# EAGLE design ver1.0 (EAGLE 7.3.0)
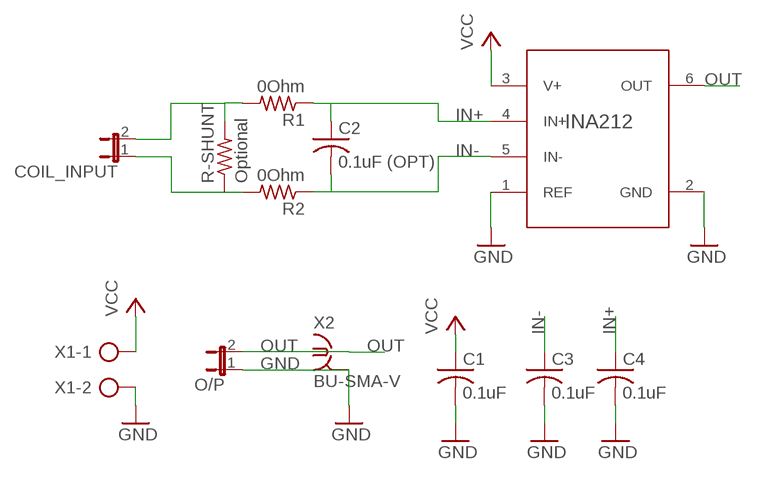
[diagram p0: schematic, sheet 1]

## Parts
C1  0.1uF  C-USC0603  [C0603]
C2  0.1uF (OPT)  C-USC0603  [C0603]
C3  0.1uF  C-USC0603  [C0603]
C4  0.1uF  C-USC0603  [C0603]
COIL_INPUT  JP1E  [JP1]
INA212  INA212AIDCKR  [DCK0006A_M]
O/P  JP1E  [JP1]
R1  0Ohm  R-US_R0603  [R0603]
R2  0Ohm  R-US_R0603  [R0603]
R-SHUNT  Optional  R-US_R0603  [R0603]
X1  AK500/2  [AK500/2]
X2  BU-SMA-V  [BU-SMA-V]

## Nets
GND: C1.2 C3.2 C4.2 INA212.1(REF) INA212.2(GND) O/P.1 X1.2 X2.2 X2.3 X2.4 X2.5
IN+: C2.1 C4.1 INA212.4(IN+) R1.1
IN-: C2.2 C3.1 INA212.5(IN-) R2.1
N$3: COIL_INPUT.2 R1.2 R-SHUNT.2
N$4: COIL_INPUT.1 R2.2 R-SHUNT.1
OUT: INA212.6(OUT) O/P.2 X2.1
VCC: C1.1 INA212.3(V+) X1.1

## Library data of the parts
C1-C4 = rcl:C-US: CAPACITOR, American symbol
COIL_INPUT O/P = jumper:JP1E: JUMPER
INA212 = INA212-BIDCKR:INA212AIDCKR
R1 R2 R-SHUNT = rcl:R-US_: RESISTOR, American symbol
X1 = con-ptr500:AK500/2: CONNECTOR; OC_FARNELL: unknown; OC_NEWARK: unknown
X2 = con-coax:BU-SMA-V: FEMALE SMA CONNECTOR Radiall distributor RS 112-3794; OC_FARNELL: unknown; OC_NEWARK: unknown

## Board
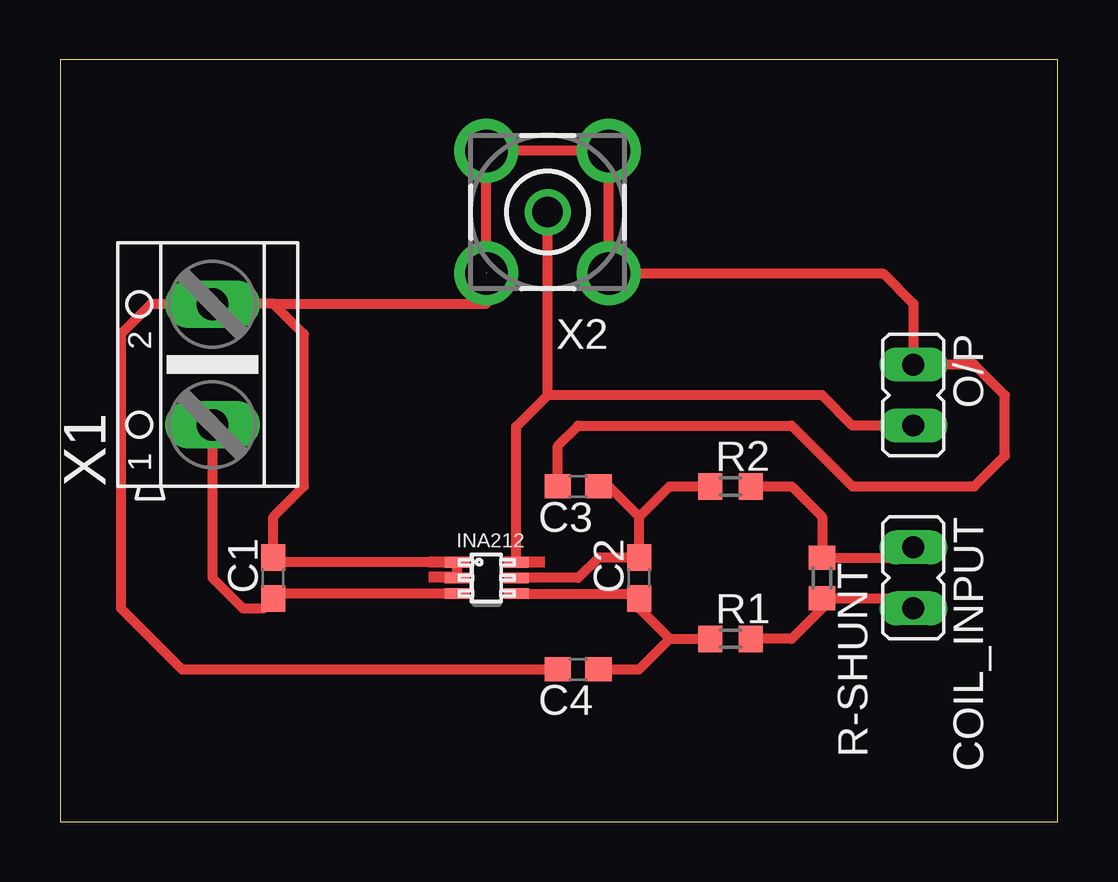
[diagram p1: board, top side]

Size 41.58 x 31.74 mm. Coordinates in mm from the lower left corner, seen from the top.
Outline: 0,0 41.58,0 41.58,31.74 0,31.74 0,0
Copper layers (1*16): Top 0.035mm / dielectric 1.5mm / Bottom 0.035mm
Design rules "default": minimum track width 10mil, minimum drill 24mil, track to track 8mil, track to pad 8mil, pad to pad 8mil, via to via 8mil, smd to smd 8mil, copper to edge 40mil, drill to drill 8mil, minimum pad ring 10mil, minimum via ring 8mil, stop-mask expansion 4mil, vias tented up to drill 0mil, thermal gap 10mil

### Footprints (pad centres in the part's own frame; a part is rotated, then mirrored left to right if it is on the bottom)
C0603 = smd 1.1 x 1: 1 -0.85,0; 2 0.85,0
JP1 = drill 0.914 long: 1 0,-1.27; 2 0,1.27
DCK0006A_M = smd 1.05 x 0.45: 1 -1.225,0.65; 2 -1.225,0; 3 -1.225,-0.65; 4 1.225,-0.65; 5 1.225,0; 6 1.225,0.65
R0603 = smd 1 x 1.1: 1 -0.85,0; 2 0.85,0
AK500/2 = drill 1.321 long: 1 -2.515,0; 2 2.515,0
BU-SMA-V = drill 1.27: 1 0,0 | drill 1.778: 2 -2.55,2.55; 3 2.55,2.55; 4 2.55,-2.55; 5 -2.55,-2.55

### Placement (x,y rotation side)
C1  8.89,10.16 90 top
C2  24.13,10.16 90 top
C3  21.59,13.97 180 top
C4  21.59,6.35 180 top
COIL_INPUT  35.56,10.16 180 top
INA212  17.78,10.16 0 top
O/P  35.56,17.78 180 top
R1  27.94,7.62 0 top
R2  27.94,13.97 0 top
R-SHUNT  31.75,10.16 270 top
X1  6.35,19.05 90 top
X2  20.32,25.4 180 top

### Tracks (layer width: path | path; a pad name or v marks a point on that pad's centre or on a via)
GND  (1 unrouted)
  Top 0.406: X2.3 X2.4 X2.5 22.87,27.93 X2.2 34.3,22.85 35.56,21.59 O/P.1 38.1,19.05 39.37,17.78 39.37,15.24 38.1,13.97 33.02,13.97 30.48,16.51 21.59,16.51 20.74,15.66 C3.2 | INA212.2 INA212.1 9.09,10.81 C1.2 8.89,12.7 10.16,13.97 10.16,20.32 8.89,21.59 | 8.89,21.59 6.38,21.59 X1.2 3.79,21.57 2.54,20.32 2.54,8.89 5.08,6.35 C4.2 | 8.89,21.59 17.78,21.59 X2.3
IN+
  Top 0.406: INA212.4 23.93,9.51 C2.1 24.13,8.89 25.4,7.62 | 25.4,7.62 R1.1 | C4.1 24.13,6.35 25.4,7.62
IN-
  Top 0.406: 24.13,12.7 C2.2 22.44,11.01 21.59,10.16 INA212.5 | 24.13,12.7 25.4,13.97 R2.1 | 24.13,12.7 22.86,13.97 C3.1
N$3
  Top 0.406: COIL_INPUT.2 35.14,9.31 R-SHUNT.2 31.75,8.89 30.48,7.62 R1.2
N$4
  Top 0.406: R2.2 30.48,13.97 31.75,12.7 R-SHUNT.1 35.14,11.01 COIL_INPUT.1
OUT
  Top 0.406: INA212.6 19,16.46 20.32,17.78 | 20.32,17.78 X2.1 | O/P.2 33.02,16.51 31.75,17.78 20.32,17.78
VCC
  Top 0.406: INA212.3 16.42,9.5 9.08,9.5 C1.1 8.47,8.89 7.62,8.89 6.35,10.16 X1.1
(copper drawn outside any net)
  shapes: Top area x3